# EAGLE board SparkFun_RTK_EVK (EAGLE 9.6.2), part 1 of 2
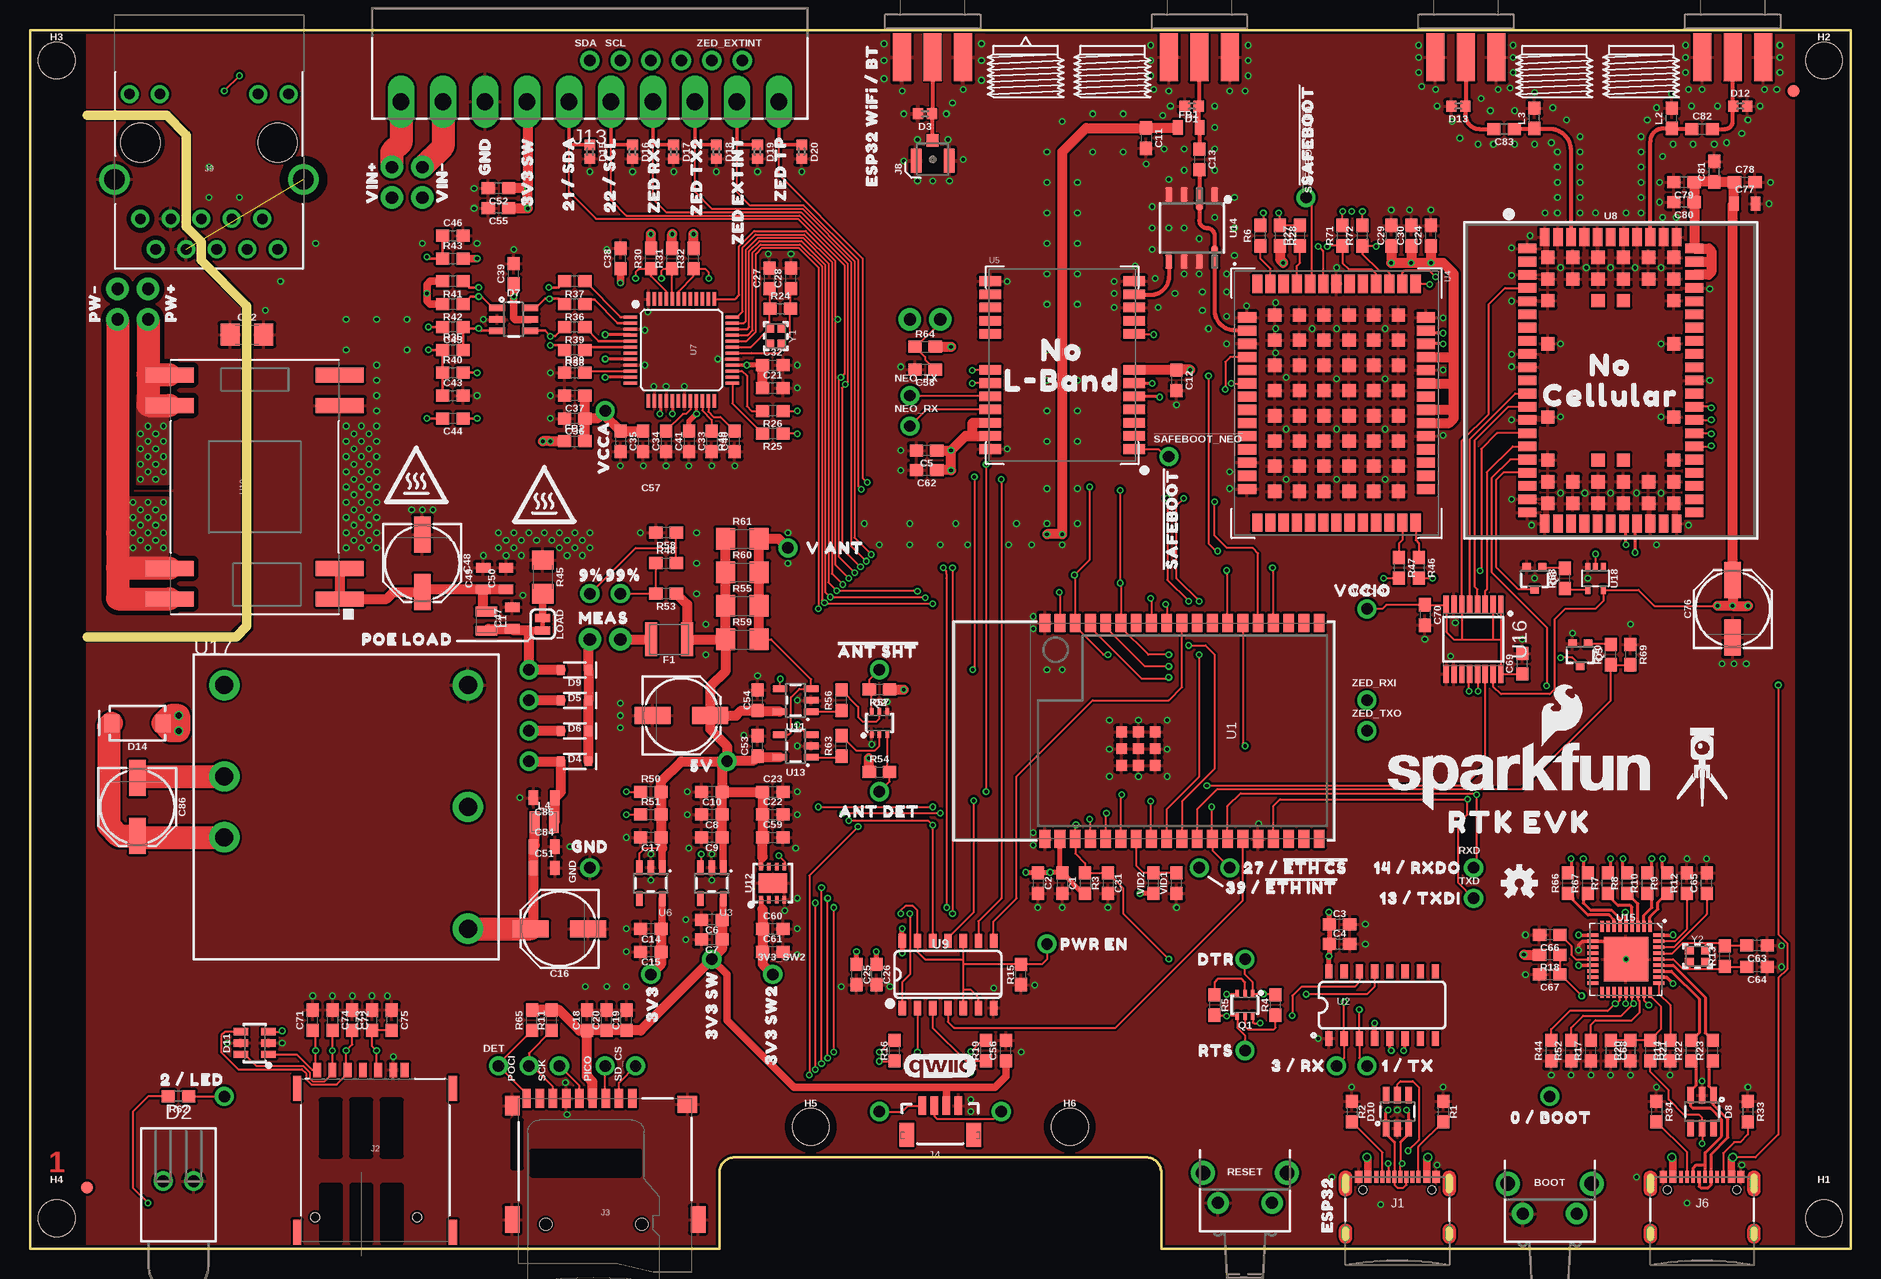
[diagram p2: board, top side]
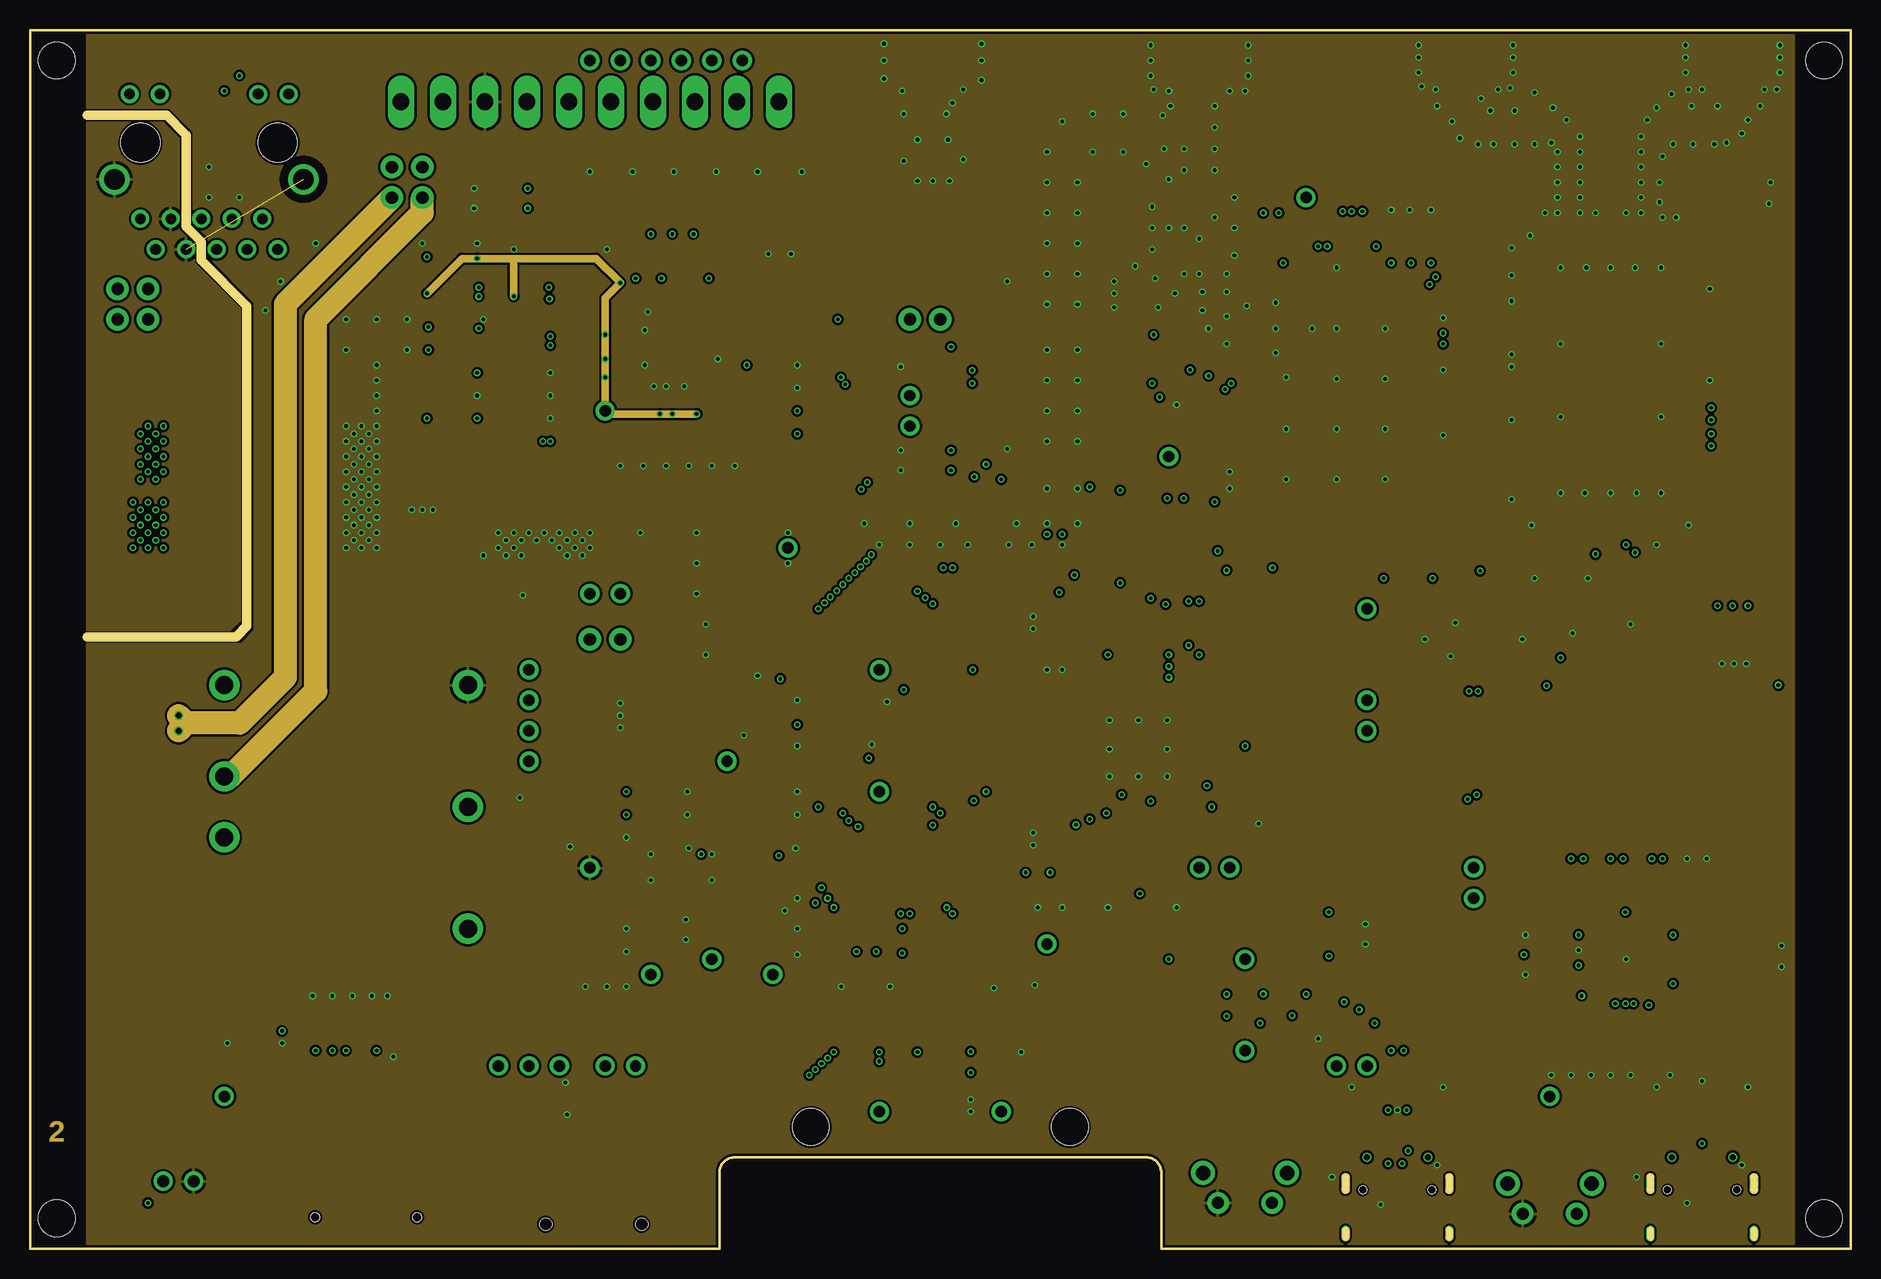
[diagram p3: board, inner layer Route2]
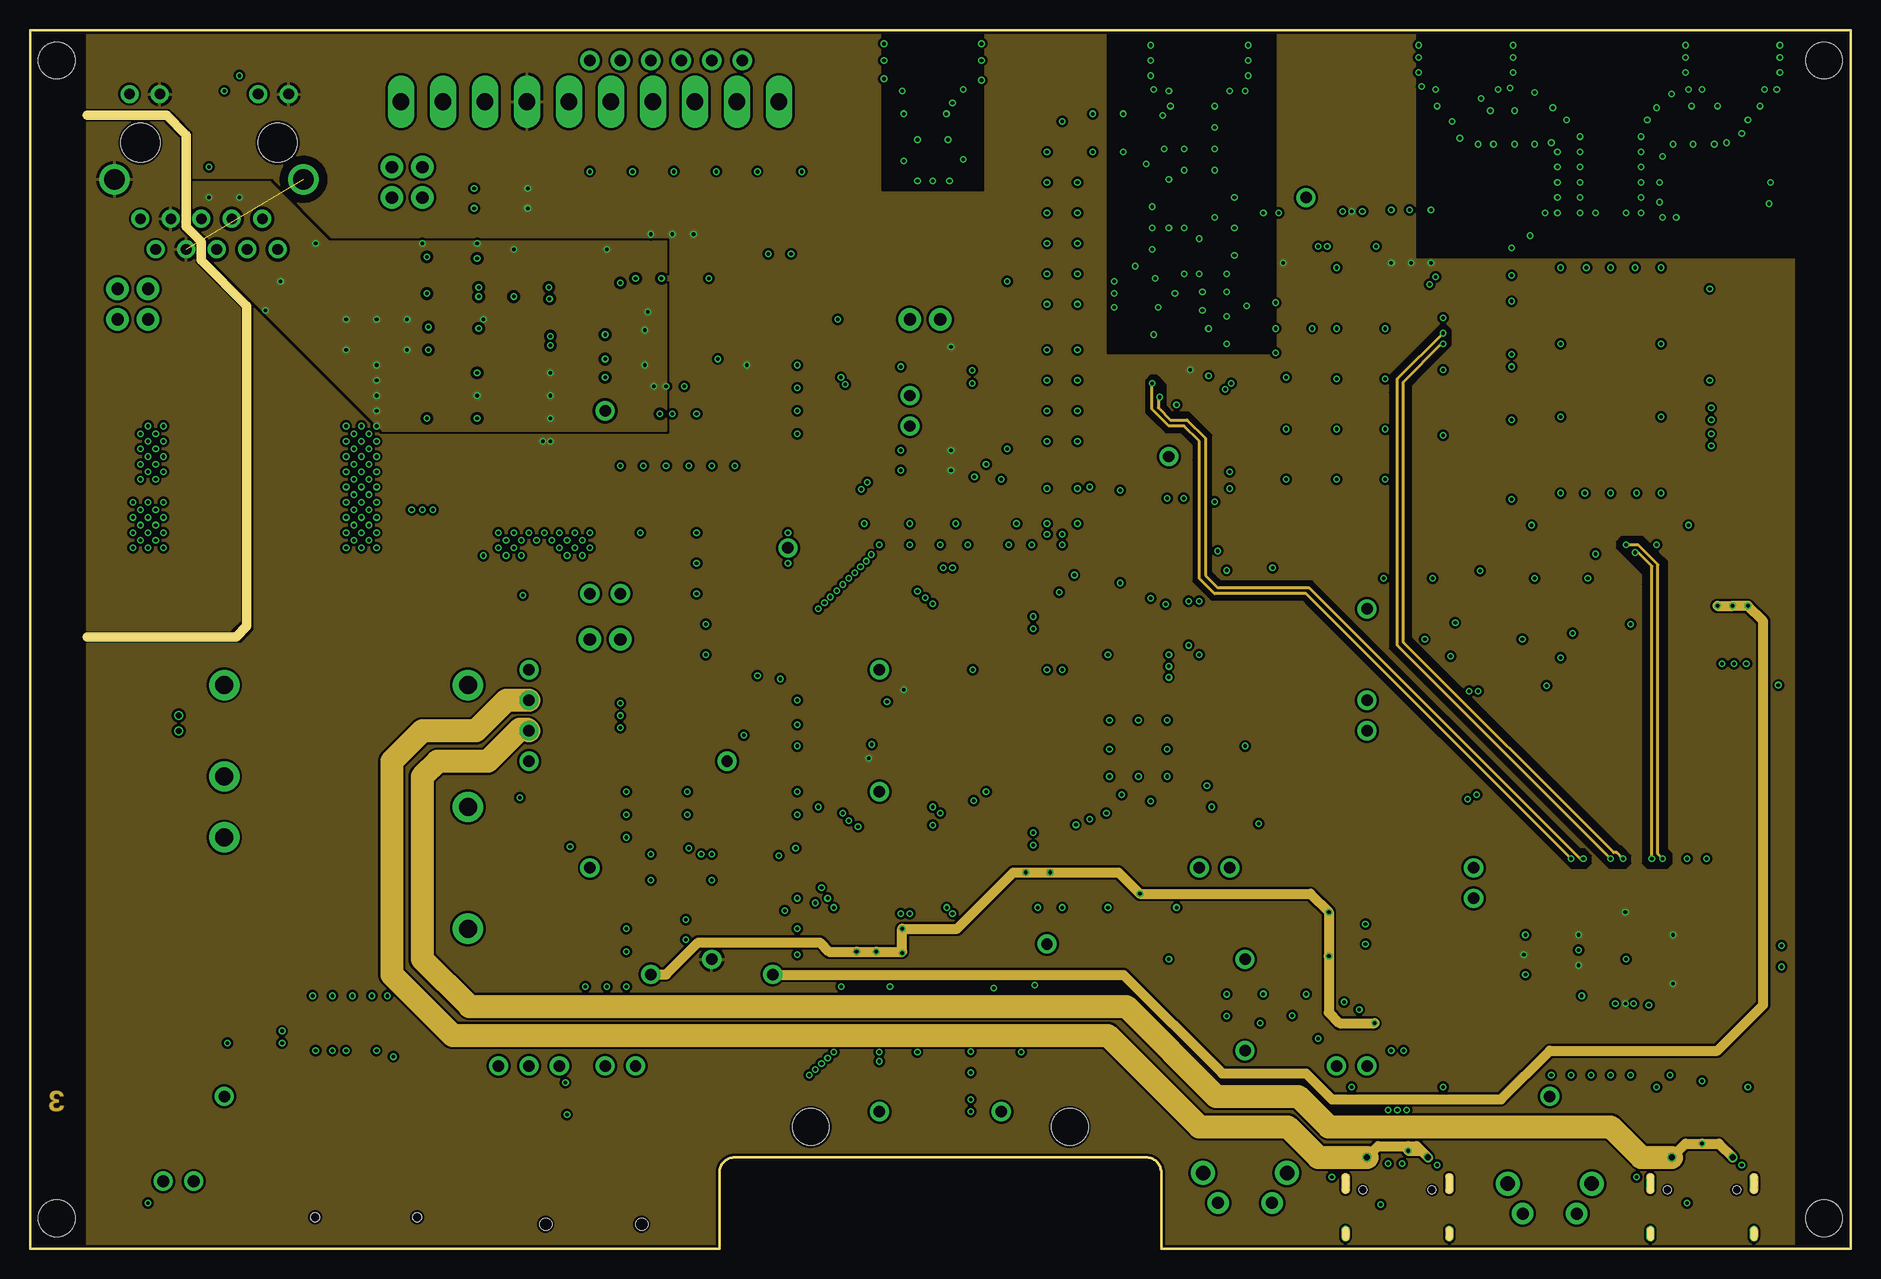
[diagram p4: board, inner layer Route15]
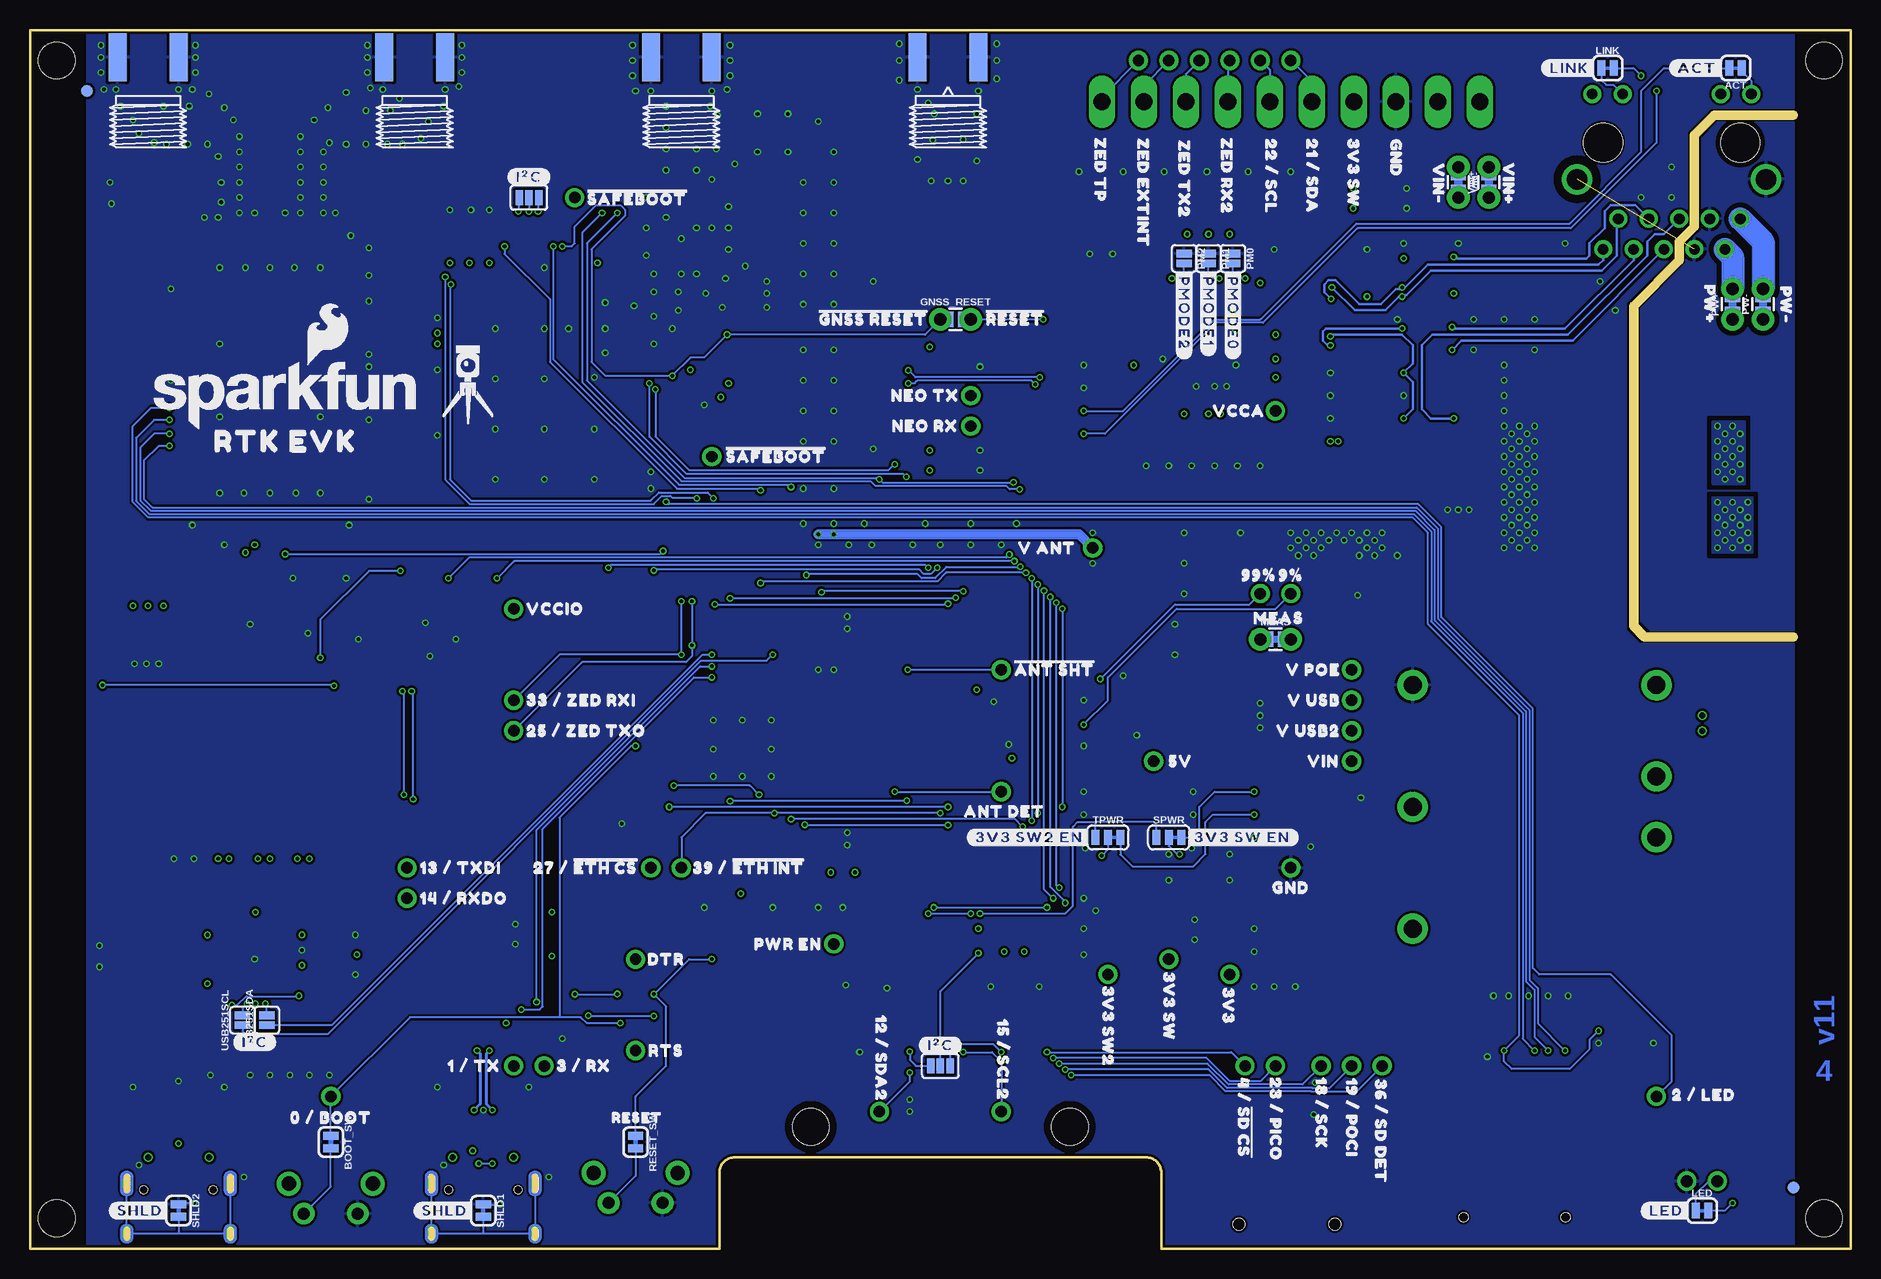
[diagram p5: board, bottom side, seen from below]

Size 151.77 x 101.6 mm. Coordinates in mm from the lower left corner, seen from the top.
Outline: 0,0 57.47,0 57.47,6.35 arc-90 58.74,7.62 93.03,7.62 arc-90 94.3,6.35 94.3,0 151.77,0 151.77,101.6 0,101.6 0,0
Copper layers (1*2*15*16): Top 0.035559375mm / dielectric 0.47751875mm / Route2 0.035559375mm / dielectric 0.47751875mm / Route15 0.035559375mm / dielectric 0.47751875mm / Bottom 0.035559375mm
Design rules "SparkFun-4-Layer-Minimum-JLCPCB": minimum track width 5mil, minimum drill 0.2mm, track to track 5mil, track to pad 5mil, pad to pad 5mil, via to via 5mil, smd to smd 5mil, copper to edge 7mil, drill to drill 7mil, minimum pad ring 5mil, minimum via ring 5mil, stop-mask expansion 2.5mil, vias tented up to drill 25mil, thermal gap 10mil
Net classes: 2 3.3V: width 0.508 mm; 3 RF_IN: width 0.35 mm, clearance 0.46 mm; 4 USB: width 0.203 mm, clearance 0.127 mm; 7 V_ZED: width 0.2 mm, clearance 0.2 mm; 8 V_RF: width 0.2 mm; 11 ZED_DIG: width 0.1 mm, clearance 0.1 mm
tKeepout: area 0,6.3 to 4.8,95.2; area 147,6.3 to 151.8,95.2
tRestrict: 1 lines
Milling: 9 lines

## Footprints (pad centres in the part's own frame; a part is rotated, then mirrored left to right if it is on the bottom)
1X01_NO_SILK = drill 0.95 pad 1.6: 1 0,0
SMT-JUMPER_2_NC_TRACE_SILK = smd 0.66 x 1.27: 1 -0.521,0; 2 0.521,0
TACTILE_SWITCH_PTH_RA_8-020 = drill 1 pad 1.8: 1 -2.25,0; 2 2.25,0 | drill 1.2 pad 2: M1 -3.5,2.5; M2 3.5,2.5
SMT-JUMPER_2_SOIC-PAD_NO-PASTE = smd 0.55 x 0.55: 1 1.75,0
0603 = smd 1.1 x 1: 1 -0.85,0; 2 0.85,0
PANASONIC_D = smd 3 x 1.4: + 2.4,0; - -2.4,0
1206 = smd 1.6 x 1.8: 1 -1.4,0; 2 1.4,0
0805 = smd 0.8 x 1.2: 1 -0.9,0; 2 0.9,0
0402 = smd 0.85 x 0.9: 1 -0.58,0; 2 0.58,0
CBI-RIGHT-ANGLE-PTH = drill 1 pad 1.6: A -1.27,5; C 1.27,5
SOD-323 = smd 0.63 x 0.83: A 1.15,0; C -1.15,0
SOT-23-6 = smd 0.55 x 1.35: 1 -0.95,-1.375; 2 0,-1.375; 3 0.95,-1.375; 4 0.95,1.375; 5 0,1.375; 6 -0.95,1.375
SOT23-6L = smd 0.6 x 1.2: 1 -0.95,-1.15; 2 0,-1.15; 3 0.95,-1.15; 4 0.95,1.15; 5 0,1.15; 6 -0.95,1.15
SMA-DIODE = smd 1.27 x 1.47: A -2.15,0; C 2.15,0
RP-SMA-EDGE = smd 1.5 x 4: GND@0 -2.54,0; GND@1 2.54,0; SIG 0,0 | smd 1.5 x 4 bottom: GND@2 -2.54,0; GND@3 2.54,0
1210 = smd 1 x 2.8: 1 -1.5,0; 2 1.5,0
FIDUCIAL-1X2 = smd 1 x 1: 1 0,0
COMBO-JUMPER_2_NO = smd 0.635 x 1.27: 1 -0.508,0; 2 0.508,0 | drill 1.016 pad 1.88: 3 -1.27,0; 4 1.27,0
SMA-EDGE = smd 1.5 x 4: GND@0 -2.54,0; GND@1 2.54,0; SIG 0,0 | smd 1.5 x 4 bottom: GND@2 -2.54,0; GND@3 2.54,0
STAND-OFF-TIGHT = hole 3.048: 0,0
SMT-JUMPER_3_NO_SILK = smd 0.635 x 1.27: 1 -0.813,0; 2 0,0; 3 0.813,0
USB-C-16P_4LAYER-PADS = smd 0.3 x 1: A5 -1.25,-0.34; A6 -0.25,-0.34; A7 0.25,-0.34; A8 1.25,-0.34; B5 1.75,-0.34; B6 0.75,-0.34; B7 -0.75,-0.34; B8 -1.75,-0.34 | smd 0.6 x 1: GND -3.225,-0.34; GND2 3.225,-0.34; VBUS1 -2.45,-0.34; VBUS2 2.45,-0.34 | drill 0.4 pad 0.6 long: SHLD1 -4.318,-0.915; SHLD2 4.318,-0.915; SHLD3 -4.318,-5.095; SHLD4 4.318,-5.095 | hole 0.65: -2.89,-1.445; 2.89,-1.445
NANO_SIM_PP = smd 0.7 x 2.1: A1 6.495,6; A2 -6.495,6; A3 -6.495,-6; A4 6.495,-6 | smd 0.65 x 1.23: C1 0.255,7.535; C2 -2.285,7.535; C3 -4.825,7.535; C5 1.525,7.535; C6 -1.015,7.535; C7 -3.555,7.535; CD 2.475,7.535 | hole 0.75: 3.505,-4.75; -4.995,-4.75
MICROSD-EXTERNALPIN = smd 0.7 x 1.6: 1 2.25,10.5; 2 1.15,10.5; 3 0.05,10.5; 4 -1.05,10.5; 5 -2.15,10.5; 6 -3.25,10.5; 7 -4.35,10.5; 8 -5.45,10.5; 9 -6.55,10.5 | smd 1.2 x 1.6: 10 -7.75,9.9 | smd 1.2 x 2.2: 11 -7.75,0.4; 12 7.75,0.4 | smd 1.6 x 1.4: 13 6.85,10 | hole 1: 3.05,0; -4.95,0
JST04_1MM_VERT = smd 0.6 x 1.55: 1 -1.5,0.775; 2 -0.5,0.775; 3 0.5,0.775; 4 1.5,0.775 | smd 1.2 x 2: NC1 -2.8,3.2; NC2 2.8,3.2
U.FL_REDUCED_FOOTPRINT = smd 2 x 0.85: 1 -0.1,1.375; 2 -0.1,-1.375 | smd 1.05 x 1: FEED 1.575,0
MAGJACK-SYM_LED = drill 0.9 pad 1.5: 1 -5.715,8.89; 2 -4.445,6.35; 3 -3.175,8.89; 4 -1.905,6.35; 5 -0.635,8.89; 6 0.635,6.35; 7 1.905,8.89; 8 3.175,6.35; 9 4.445,8.89; 10 5.715,6.35; 11 -6.63,-4.06; 12 -4.09,-4.06; 13 4.09,-4.06; 14 6.63,-4.06 | drill 1.7 pad 2.4: S1 -7.875,3.05; S2 7.875,3.05 | hole 3.25: -5.715,0; 5.715,0
1X10_SCREW_TERMINAL_3.5MM = drill 1.4 pad 2.2 long: 1 -15.75,2.8; 2 -12.25,2.8; 3 -8.75,2.8; 4 -5.25,2.8; 5 -1.75,2.8; 6 1.75,2.8; 7 5.25,2.8; 8 8.75,2.8; 9 12.25,2.8; 10 15.75,2.8
0805-WIDE = smd 0.8 x 1.8: 1 -0.8,0; 2 0.8,0
0603_NO-CREAM = smd 1.1 x 1: 1 -0.85,0; 2 0.85,0
COMBO-JUMPER_2_NC_TRACE = smd 0.635 x 1.27: 1 -0.508,0; 2 0.508,0 | drill 1.016 pad 1.88: 3 -1.27,0; 4 1.27,0
SMT-JUMPER_2_NO_SILK = smd 0.635 x 1.27: 1 -0.406,0; 2 0.406,0
SC70-6 = smd 0.3 x 0.66: 1 -0.65,-0.92; 2 0,-0.92; 3 0.65,-0.92; 4 0.65,0.92; 5 0,0.92; 6 -0.65,0.92
SOT323 = smd 0.7 x 0.7: 1 -0.65,-0.925; 2 0.65,-0.925; 3 0,0.925
SMT-JUMPER_3_1-NC_TRACE_SILK = smd 0.66 x 1.27: 1 -1.041,0; 2 0,0; 3 1.041,0
ESP32-WROVER-E/IE = smd 0.9 x 1.5: 1 7.8,9; 2 6.53,9; 3 5.26,9; 4 3.99,9; 5 2.72,9; 6 1.45,9; 7 0.18,9; 8 -1.09,9; 9 -2.36,9; 10 -3.63,9; 11 -4.9,9; 12 -6.17,9; 13 -7.44,9; 14 -8.71,9; 15 -9.98,9; 16 -11.25,9; 17 -12.52,9; 18 -13.79,9; 19 -15.06,9; 20 -15.06,-9; 21 -13.79,-9; 22 -12.52,-9; 23 -11.25,-9; 24 -9.98,-9; 25 -8.71,-9; 26 -7.44,-9; 27 -6.17,-9; 28 -4.9,-9; 29 -3.63,-9; 30 -2.36,-9; 31 -1.09,-9; 32 0.18,-9; 33 1.45,-9; 34 2.72,-9; 35 3.99,-9; 36 5.26,-9; 37 6.53,-9; 38 7.8,-9 | smd 0.9 x 0.9: GND 0,1.5; GNDT1 -1.4,2.9; GNDT2 -1.4,1.5; GNDT3 -1.4,0.1; GNDT4 0,0.1; GNDT5 1.4,0.1; GNDT6 1.4,1.5; GNDT7 1.4,2.9; GNDT8 0,2.9
SO016 = smd 0.6 x 1.2: 1 -4.445,-2.8; 2 -3.175,-2.8; 3 -1.905,-2.8; 4 -0.635,-2.8; 5 0.635,-2.8; 6 1.905,-2.8; 7 3.175,-2.8; 8 4.445,-2.8; 9 4.445,2.8; 10 3.175,2.8; 11 1.905,2.8; 12 0.635,2.8; 13 -0.635,2.8; 14 -1.905,2.8; 15 -3.175,2.8; 16 -4.445,2.8
SOT23-5 = smd 0.55 x 1.2: 1 -0.95,-1.3; 2 0,-1.3; 3 0.95,-1.3; 4 0.95,1.3; 5 -0.95,1.3
ZED-F9P = smd 0.85 x 1.52: 1 -7.15,-7.45; 2 -6.05,-7.45; 3 -4.95,-7.45; 4 -3.85,-7.45; 5 -2.75,-7.45; 6 -1.65,-7.45; 7 -0.55,-7.45; 8 0.55,-7.45; 9 1.65,-7.45; 10 2.75,-7.45; 11 3.85,-7.45; 12 4.95,-7.45; 13 6.05,-7.45; 14 7.15,-7.45; 28 7.15,7.45; 29 6.05,7.45; 30 4.95,7.45; 31 3.85,7.45; 32 2.75,7.45; 33 1.65,7.45; 34 0.55,7.45; 35 -0.55,7.45; 36 -1.65,7.45; 37 -2.75,7.45; 38 -3.85,7.45; 39 -4.95,7.45; 40 -6.05,7.45; 41 -7.15,7.45 | smd 1.52 x 0.85: 15 9.95,-6.6; 16 9.95,-5.5; 17 9.95,-4.4; 18 9.95,-3.3; 19 9.95,-2.2; 20 9.95,-1.1; 21 9.95,0; 22 9.95,1.1; 23 9.95,2.2; 24 9.95,3.3; 25 9.95,4.4; 26 9.95,5.5; 27 9.95,6.6; 42 -9.95,6.6; 43 -9.95,5.5; 44 -9.95,4.4; 45 -9.95,3.3; 46 -9.95,2.2; 47 -9.95,1.1; 48 -9.95,0; 49 -9.95,-1.1; 50 -9.95,-2.2; 51 -9.95,-3.3; 52 -9.95,-4.4; 53 -9.95,-5.5; 54 -9.95,-6.6 | smd 1.1 x 1.1: 55 -1.05,-1.05; 56 -3.15,-1.05; 57 -5.25,-1.05; 58 -7.35,-1.05; 59 -1.05,-3.1; 60 -3.15,-3.1; 61 -5.25,-3.1; 62 -7.35,-3.1; 63 -1.05,-5.15; 64 -3.15,-5.15; 65 -5.25,-5.15; 66 -7.35,-5.15; 67 -1.05,5.15; 68 -3.15,5.15; 69 -5.25,5.15; 70 -7.35,5.15; 71 -1.05,3.1; 72 -3.15,3.1; 73 -5.25,3.1; 74 -7.35,3.1; 75 -1.05,1.05; 76 -3.15,1.05; 77 -5.25,1.05; 78 -7.35,1.05; 79 1.05,1.05; 80 3.15,1.05; 81 5.25,1.05; 82 7.35,1.05; 83 1.05,3.1; 84 3.15,3.1; 85 5.25,3.1; 86 7.35,3.1; 87 1.05,5.15; 88 3.15,5.15; 89 5.25,5.15; 90 7.35,5.15; 91 1.05,-5.15; 92 3.15,-5.15; 93 5.25,-5.15; 94 7.35,-5.15; 95 1.05,-3.1; 96 3.15,-3.1; 97 5.25,-3.1; 98 7.35,-3.1; 99 1.05,-1.05; 100 3.15,-1.05; 101 5.25,-1.05; 102 7.35,-1.05
NEO-M9N/M8T/M8U/D9S = smd 1.8 x 0.8: 1 6,-7; 2 6,-5.9; 3 6,-4.8; 4 6,-3.7; 5 6,-2.6; 6 6,-1.5; 7 6,-0.4; 8 6,2.6; 9 6,3.7; 10 6,4.8; 11 6,5.9; 12 6,7; 13 -6,7; 14 -6,5.9; 15 -6,4.8; 16 -6,3.7; 17 -6,2.6; 18 -6,-0.4; 19 -6,-1.5; 20 -6,-2.6; 21 -6,-3.7; 22 -6,-4.8; 23 -6,-5.9; 24 -6,-7
LQFP-48 = smd 0.254 x 1.143: 1 -2.75,-4.25; 2 -2.25,-4.25; 3 -1.75,-4.25; 4 -1.25,-4.25; 5 -0.75,-4.25; 6 -0.25,-4.25; 7 0.25,-4.25; 8 0.75,-4.25; 9 1.25,-4.25; 10 1.75,-4.25; 11 2.25,-4.25; 12 2.75,-4.25; 25 2.75,4.25; 26 2.25,4.25; 27 1.75,4.25; 28 1.25,4.25; 29 0.75,4.25; 30 0.25,4.25; 31 -0.25,4.25; 32 -0.75,4.25; 33 -1.25,4.25; 34 -1.75,4.25; 35 -2.25,4.25; 36 -2.75,4.25 | smd 1.143 x 0.254: 13 4.25,-2.75; 14 4.25,-2.25; 15 4.25,-1.75; 16 4.25,-1.25; 17 4.25,-0.75; 18 4.25,-0.25; 19 4.25,0.25; 20 4.25,0.75; 21 4.25,1.25; 22 4.25,1.75; 23 4.25,2.25; 24 4.25,2.75; 37 -4.25,2.75; 38 -4.25,2.25; 39 -4.25,1.75; 40 -4.25,1.25; 41 -4.25,0.75; 42 -4.25,0.25; 43 -4.25,-0.25; 44 -4.25,-0.75; 45 -4.25,-1.25; 46 -4.25,-1.75; 47 -4.25,-2.25; 48 -4.25,-2.75
LARA-LGA = smd 0.8 x 1.5: 1 -11,-6.95; 2 -9.9,-6.95; 3 -8.8,-6.95; 4 -7.7,-6.95; 5 -6.6,-6.95; 6 -5.5,-6.95; 7 -4.4,-6.95; 8 -3.3,-6.95; 9 -2.2,-6.95; 10 -1.1,-6.95; 11 0,-6.95; 12 1.1,-6.95; 13 2.2,-6.95; 14 3.3,-6.95; 15 4.4,-6.95; 16 5.5,-6.95; 17 6.6,-6.95; 18 7.7,-6.95; 19 8.8,-6.95; 20 9.9,-6.95; 21 11,-6.95; 33 11,6.95; 34 9.9,6.95; 35 8.8,6.95; 36 7.7,6.95; 37 6.6,6.95; 38 5.5,6.95; 39 4.4,6.95; 40 3.3,6.95; 41 2.2,6.95; 42 1.1,6.95; 43 0,6.95; 44 -1.1,6.95; 45 -2.2,6.95; 46 -3.3,6.95; 47 -4.4,6.95; 48 -5.5,6.95; 49 -6.6,6.95; 50 -7.7,6.95; 51 -8.8,6.95; 52 -9.9,6.95; 53 -11,6.95 | smd 1.5 x 0.8: 22 11.95,-5.5; 23 11.95,-4.4; 24 11.95,-3.3; 25 11.95,-2.2; 26 11.95,-1.1; 27 11.95,0; 28 11.95,1.1; 29 11.95,2.2; 30 11.95,3.3; 31 11.95,4.4; 32 11.95,5.5; 54 -11.95,5.5; 55 -11.95,4.4; 56 -11.95,3.3; 57 -11.95,2.2; 58 -11.95,1.1; 59 -11.95,0; 60 -11.95,-1.1; 61 -11.95,-2.2; 62 -11.95,-3.3; 63 -11.95,-4.4; 64 -11.95,-5.5 | smd 1.1 x 1.1: 65 -10.25,-5.25; 66 -10.25,-3.15; 67 -10.25,-1.05; 68 -10.25,1.05; 69 -10.25,3.15; 70 -10.25,5.25; 71 -8.45,-5.25; 72 -8.45,-3.15; 73 -8.45,-1.05; 74 -8.45,1.05; 75 -8.45,3.15; 76 -8.45,5.25; 77 -6.65,-5.25; 78 -6.65,5.25; 79 -3.05,-5.25; 80 -3.05,5.25; 81 3.05,-5.25; 82 3.05,5.25; 83 6.65,-5.25; 84 6.65,5.25; 85 8.45,-5.25; 86 8.45,-3.15; 87 8.45,-1.05; 88 8.45,1.05; 89 8.45,3.15; 90 8.45,5.25; 91 10.25,-5.25; 92 10.25,-3.15; 93 10.25,-1.05; 94 10.25,1.05; 95 10.25,3.15; 96 10.25,5.25; 97 -6.65,-1.05; 98 -6.65,1.05; 99 6.65,-1.05; 100 6.65,1.05
SO14 = smd 0.6 x 1.2: 1 -3.175,-2.8; 2 -1.905,-2.8; 3 -0.635,-2.8; 4 0.635,-2.8; 5 1.905,-2.8; 6 3.175,-2.8; 7 4.445,-2.8; 8 4.445,2.8; 9 3.175,2.8; 10 1.905,2.8; 11 0.635,2.8; 12 -0.635,2.8; 13 -1.905,2.8; 14 -3.175,2.8
DP990X = smd 1.25 x 4: 1 -9.33,-7.1; 2 -6.79,-7.1; 3 6.79,-7.1; 4 9.33,-7.1; 5 9.33,7.1; 6 6.79,7.1; 7 -6.79,7.1; 8 -9.33,7.1
UDFN-8 = smd 0.3 x 0.65: 1 -0.975,-1.375; 2 -0.325,-1.375; 3 0.325,-1.375; 4 0.975,-1.375; 5 0.975,1.375; 6 0.325,1.375; 7 -0.325,1.375; 8 -0.975,1.375 | smd 2.35 x 1.6: EP 0,0
XX21 = smd 0.6 x 1.2: 1 -1.905,-2.8; 2 -0.635,-2.8; 3 0.635,-2.8; 4 1.905,-2.8; 5 1.905,2.8; 6 0.635,2.8; 7 -0.635,2.8; 8 -1.905,2.8
QFN-36 = smd 0.9 x 0.28: 1 -2.75,2; 2 -2.75,1.5; 3 -2.75,1; 4 -2.75,0.5; 5 -2.75,0; 6 -2.75,-0.5; 7 -2.75,-1; 8 -2.75,-1.5; 9 -2.75,-2; 19 2.75,-2; 20 2.75,-1.5; 21 2.75,-1; 22 2.75,-0.5; 23 2.75,0; 24 2.75,0.5; 25 2.75,1; 26 2.75,1.5; 27 2.75,2 | smd 0.28 x 0.9: 10 -2,-2.75; 11 -1.5,-2.75; 12 -1,-2.75; 13 -0.5,-2.75; 14 0,-2.75; 15 0.5,-2.75; 16 1,-2.75; 17 1.5,-2.75; 18 2,-2.75; 28 2,2.75; 29 1.5,2.75; 30 1,2.75; 31 0.5,2.75; 32 0,2.75; 33 -0.5,2.75; 34 -1,2.75; 35 -1.5,2.75; 36 -2,2.75 | smd 3.7 x 3.7: EP 0,0
SOP65P640X120-16N = smd 1.5 x 0.45: 1 -2.9,2.275; 2 -2.9,1.625; 3 -2.9,0.975; 4 -2.9,0.325; 5 -2.9,-0.325; 6 -2.9,-0.975; 7 -2.9,-1.625; 8 -2.9,-2.275; 9 2.9,-2.275; 10 2.9,-1.625; 11 2.9,-0.975; 12 2.9,-0.325; 13 2.9,0.325; 14 2.9,0.975; 15 2.9,1.625; 16 2.9,2.275
URB_YMD-15WR3 = drill 1.499 pad 2.54: 1 -10.16,10.16; 2 -10.16,2.54; 3 -10.16,-2.54; 4 10.16,-10.16; 5 10.16,0; 6 10.16,10.16
SOT353 = smd 0.42 x 0.7: 1 -0.65,-0.95; 2 0,-0.95; 3 0.65,-0.95; 4 0.65,0.95; 5 -0.65,0.95
CRYSTAL-SMD-2.0X1.6MM = smd 0.75 x 0.7: 1 -0.675,-0.5; 2 0.675,-0.5; 3 0.675,0.5; 4 -0.675,0.5

## Placement (x,y rotation side)
3V3  TEST-POINTPOGO_PTH  [1X01_NO_SILK]  51.75,22.86 270 top
3V3_SW  TEST-POINTPOGO_PTH  [1X01_NO_SILK]  56.83,24.13 270 top
3V3_SW2  TEST-POINTPOGO_PTH  [1X01_NO_SILK]  61.91,22.86 0 top
5V  TEST-POINTPOGO_PTH  [1X01_NO_SILK]  58.1,40.64 270 top
9%  TEST-POINTPOGO_PTH  [1X01_NO_SILK]  46.67,54.61 0 top
99%  TEST-POINTPOGO_PTH  [1X01_NO_SILK]  49.21,54.61 0 top
!SAFEBOOT_NEO!  TEST-POINTPOGO_PTH  [1X01_NO_SILK]  94.93,66.04 0 top
!SAFEBOOT_ZED!  TEST-POINTPOGO_PTH  [1X01_NO_SILK]  106.36,87.63 0 top
ACT  JUMPER-SMT_2_NC_TRACE_SILK  [SMT-JUMPER_2_NC_TRACE_SILK]  9.59,98.42 180 bottom
ANT_DET  TEST-POINTPOGO_PTH  [1X01_NO_SILK]  70.8,38.1 0 top
ANT_SHT  TEST-POINTPOGO_PTH  [1X01_NO_SILK]  70.8,48.26 0 top
BOOT  MOMENTARY-SWITCH-SPST-PTH-RIGHT-ANGLE-8-020  [TACTILE_SWITCH_PTH_RA_8-020]  126.68,2.92 0 top
BOOT_SW  JUMPER-SMT_2_NC_TRACE_SILK  [SMT-JUMPER_2_NC_TRACE_SILK]  126.68,8.89 270 bottom
BYPASS1  NO PASTE  [SMT-JUMPER_2_SOIC-PAD_NO-PASTE]  97.47,85.09 90 top
BYPASS2  NO PASTE  [SMT-JUMPER_2_SOIC-PAD_NO-PASTE]  98.74,85.09 270 top
C1  2.2uF  [0603]  86.04,30.48 270 top
C2  0.1uF  [0603]  84.01,30.48 270 top
C3  2.2uF  [0603]  109.16,27.05 0 top
C4  10nF  [0603]  109.16,25.4 0 top
C5  2.2uF  [0603]  74.74,66.55 180 top
C6  2.2uF  [0603]  56.83,27.43 180 top
C7  0.1uF  [0603]  56.83,25.78 180 top
C8  2.2uF  [0603]  56.83,36.2 180 top
C9  2.2uF  [0603]  56.83,34.29 180 top
C10  2.2uF  [0603]  56.83,38.1 180 top
C11  47pF  [0603]  93.03,92.58 270 top
C12  1.0uF  [0603]  95.57,72.39 270 top
C13  47pF  [0603]  97.47,90.81 270 top
C14  2.2uF  [0603]  51.75,26.67 180 top
C15  0.1uF  [0603]  51.75,24.77 180 top
C16  100uF  [PANASONIC_D]  44.13,26.67 180 top
C17  0.1uF  [0603]  51.75,34.29 180 top
C18  2.2uF  [0603]  46.42,19.05 90 top
C19  0.1uF  [0603]  49.72,19.05 90 top
C20  10uF  [0603]  48.07,19.05 90 top
C21  0.1uF  [0603]  61.91,71.75 0 top
C22  2.2uF  [0603]  61.91,36.2 0 top
C23  2.2uF  [0603]  61.91,38.1 0 top
C24  1.0uF  [0603]  116.78,84.45 90 top
C25  2.2uF  [0603]  68.9,22.86 270 top
C26  2.2uF  [0603]  70.55,22.86 270 top
C27  10pF  [0603]  61.66,80.9 90 top
C28  10pF  [0603]  63.44,80.9 90 top
C29  2.2uF  [0603]  113.47,84.45 90 top
C30  0.1uF  [0603]  115.13,84.45 90 top
C31  0.1uF  [0603]  89.85,30.48 270 top
C32  10uF  [0603]  61.91,73.66 0 top
C33  0.1uF  [0603]  54.93,67.31 270 top
C34  0.1uF  [0603]  51.12,67.31 270 top
C35  0.1uF  [0603]  49.21,67.31 270 top
C36  0.1uF  [0603]  45.4,69.22 180 top
C37  0.1uF  [0603]  45.4,71.12 180 top
C38  0.1uF  [0603]  49.21,82.55 90 top
C39  10uF  [0603]  40.32,81.28 90 top
C40  10nF  [0603]  56.83,67.31 270 top
C41  4.7uF  [0603]  53.02,67.31 270 top
C42  1nF  [1206]  18.08,76.2 0 top
C43  10nF  [0603]  35.24,71.12 0 top
C44  6.8nF  [0603]  35.24,69.22 180 top
C45  6.8nF  [0603]  35.24,76.83 180 top
C46  22nF  [0603]  35.24,84.45 0 top
C47  10uF  [0805]  40.2,52.58 90 top
C48  100uF  [PANASONIC_D]  32.7,57.15 270 top
C49  10uF  [0805]  37.78,55.88 90 top
C50  10uF  [0805]  39.69,55.88 90 top
C51  10uF  [0805]  42.86,31.75 0 top
C52  0.1uF  [0603]  39.05,88.39 180 top
C53  0.1uF  [0603]  60.64,41.91 90 top
C54  0.1uF  [0603]  60.64,45.72 90 top
C55  10uF  [0603]  39.05,86.74 180 top
C56  2.2uF  [0603]  81.34,16.51 90 top
C57  100uF  [PANASONIC_D]  54.29,44.45 0 top
C58  0.1uF  [0603]  74.61,73.28 180 top
C59  2.2uF  [0603]  61.91,34.29 0 top
C60  2.2uF  [0603]  61.91,26.67 0 top
C61  0.1uF  [0603]  61.91,24.77 0 top
C62  0.1uF  [0603]  74.74,64.9 180 top
C63  18pF  [0603]  143.95,25.27 180 top
C64  18pF  [0603]  143.95,23.5 180 top
C65  0.1uF  [0603]  139.76,30.48 90 top
C66  0.1uF  [0603]  126.68,26.16 180 top
C67  0.1uF  [0603]  126.68,22.86 180 top
C68  0.1uF  [0603]  131.76,16.51 270 top
C69  0.1uF  [0603]  124.4,48.77 90 top
C70  0.1uF  [0603]  116.27,52.83 270 top
C71  47pF  [0603]  23.56,19.05 90 top
C72  47pF  [0603]  26.86,19.05 270 top
C73  47pF  [0603]  28.51,19.05 90 top
C74  47pF  [0603]  25.21,19.05 270 top
C75  0.1uF  [0603]  30.16,19.05 270 top
C76  100uF  [PANASONIC_D]  141.92,53.34 90 top
C77  10uF  [0805]  142.94,87.12 0 top
C78  0.1uF  [0603]  142.94,88.9 0 top
C79  15pF  [0603]  137.86,88.9 180 top
C80  8.2pF  [0603]  137.86,87.25 180 top
C81  68pF  [0603]  140.4,89.79 90 top
C82  33pF  [0603]  139.38,93.34 0 top
C83  33pF  [0603]  122.87,93.34 180 top
C84  10uF  [0805]  42.86,33.53 0 top
C85  10uF  [0805]  42.86,37.59 180 top
C86  47UF  [PANASONIC_D]  8.95,36.83 270 top
D1  PESD0402-0402  [0402]  96.84,95.25 180 top
D2  LED-RIGHT-ANGLE-PTH-GREEN  [CBI-RIGHT-ANGLE-PTH]  12.38,0.64 0 top
D3  PESD0402  [0402]  74.61,94.61 180 top
D4  3A/10V/280mV  [SOD-323]  45.4,40.64 180 top
D5  3A/10V/280mV  [SOD-323]  45.4,45.72 180 top
D6  3A/10V/280mV  [SOD-323]  45.4,43.18 180 top
D7  ESD Diode  [SOT-23-6]  40.32,77.47 270 top
D8  ESD Diode  [SOT-23-6]  139.38,11.43 180 top
D9  3A/10V/280mV  [SOD-323]  45.4,48.26 180 top
D10  ESD Diode  [SOT-23-6]  113.98,11.43 0 top
D11  TVS_DIODE  [SOT23-6L]  18.73,17.14 90 top
D12  PESD0402-0402  [0402]  142.56,95.25 0 top
D13  PESD0402-0402  [0402]  119.06,95.25 180 top
D14  3A/40V  [SMA-DIODE]  8.95,43.81 180 top
D15  PESD0402-0402  [0402]  46.67,91.44 270 top
D16  PESD0402-0402  [0402]  50.23,91.44 270 top
D17  PESD0402-0402  [0402]  53.66,91.44 270 top
D18  PESD0402-0402  [0402]  57.21,91.44 270 top
D19  PESD0402-0402  [0402]  60.64,91.44 270 top
D20  PESD0402-0402  [0402]  64.33,91.44 270 top
DET  TEST-POINTPOGO_PTH  [1X01_NO_SILK]  39.05,15.24 0 top
DTR  TEST-POINTPOGO_PTH  [1X01_NO_SILK]  101.28,24.13 0 top
ESP32_RF  ANTENNA-SMA-GROUNDEDEDGE_RPSMA  [RP-SMA-EDGE]  75.25,99.31 0 top
ETH_CS  TEST-POINTPOGO_PTH  [1X01_NO_SILK]  100.01,31.75 0 top
ETH_INT  TEST-POINTPOGO_PTH  [1X01_NO_SILK]  97.47,31.75 0 top
F1  6V/2A  [1210]  53.28,50.8 180 top
FB1  600Ω  [0805]  96.58,93.47 0 top
FB2  470Ω  [0603]  45.4,67.31 0 top
FD1  FIDUCIAL1X2  [FIDUCIAL-1X2]  4.76,5.08 0 bottom
FD2  FIDUCIAL1X2  [FIDUCIAL-1X2]  4.76,5.08 0 top
FD3  FIDUCIAL1X2  [FIDUCIAL-1X2]  147,96.52 0 bottom
FD4  FIDUCIAL1X2  [FIDUCIAL-1X2]  147,96.52 0 top
FRAME1  FRAME-LEDGER  [CREATIVE_COMMONS]  185.1,0 0 top  (outside the outline)
FRAME2  FRAME-LEDGERNO_FOOTPRINT  [DUMMY]  185.1,1.27 0 top  (outside the outline)
GND  TEST-POINTPOGO_PTH  [1X01_NO_SILK]  46.67,31.75 90 top
GNSS_RESET  JUMPER-COMBO_2_NO  [COMBO-JUMPER_2_NO]  74.61,77.47 0 bottom
GNSS_RF  ANTENNA-SMA-GROUNDEDEDGE_SMA  [SMA-EDGE]  97.47,99.31 0 top
H1  STAND-OFFTIGHT  [STAND-OFF-TIGHT]  149.54,2.54 0 top
H2  STAND-OFFTIGHT  [STAND-OFF-TIGHT]  149.54,99.06 0 top
H3  STAND-OFFTIGHT  [STAND-OFF-TIGHT]  2.22,99.06 0 top
H4  STAND-OFFTIGHT  [STAND-OFF-TIGHT]  2.22,2.54 0 top
H5  STAND-OFFTIGHT  [STAND-OFF-TIGHT]  65.09,10.16 0 top
H6  STAND-OFFTIGHT  [STAND-OFF-TIGHT]  86.68,10.16 0 top
I2C  JUMPER-SMT_3_NO_SILK  [SMT-JUMPER_3_NO_SILK]  75.88,15.24 0 bottom
I2C1  JUMPER-SMT_3_NO_SILK  [SMT-JUMPER_3_NO_SILK]  110.17,87.63 0 bottom
J1  [USB-C-16P_4LAYER-PADS]  113.98,6.35 0 top
J2  [NANO_SIM_PP]  28.77,7.37 0 top
J3  MICRO-SD-PUSH-PUSH-EXT-PIN  [MICROSD-EXTERNALPIN]  47.94,2.03 0 top
J4  Vertical Qwiic Connector  [JST04_1MM_VERT]  75.88,12.7 180 top
J6  [USB-C-16P_4LAYER-PADS]  139.38,6.35 0 top
J8  [U.FL_REDUCED_FOOTPRINT]  75.25,90.81 90 top
J9  MAGJACK-POE  [MAGJACK-SYM_LED]  14.92,92.2 180 top
J13  [1X10_SCREW_TERMINAL_3.5MM]  46.67,98.42 180 top
L1  2.2uH  [0805-WIDE]  38.04,52.32 270 top
L2  DNP  [0603_NO-CREAM]  136.84,94.23 90 top
L3  DNP  [0603_NO-CREAM]  125.41,94.23 90 top
L4  2.2uH  [0805-WIDE]  42.86,35.56 0 top
LARA_RF1  ANTENNA-SMA-GROUNDEDEDGE_SMA  [SMA-EDGE]  141.92,99.31 0 top
LARA_RF2  ANTENNA-SMA-GROUNDEDEDGE_SMA  [SMA-EDGE]  119.7,99.31 0 top
LED  JUMPER-SMT_2_NC_TRACE_SILK  [SMT-JUMPER_2_NC_TRACE_SILK]  12.38,3.17 0 bottom
LINK  JUMPER-SMT_2_NC_TRACE_SILK  [SMT-JUMPER_2_NC_TRACE_SILK]  20.26,98.42 0 bottom
LOAD  JUMPER-SMT_2_NC_TRACE_SILK  [SMT-JUMPER_2_NC_TRACE_SILK]  42.74,52.07 270 top
LOGO1  SPECIAL_INSTRUCTIONS-ORDERING  [ORDERING_INSTRUCTIONS]  157.16,60.96 0 top  (outside the outline)
LOGO2  QWIIC_LOGO_6MM  [QWIIC_6MM]  75.88,15.24 0 top
LOGO4  OSHW-LOGOS  [OSHW-LOGO-S]  124.14,30.48 0 top
LOGO5  SFE_LOGO_NAME.2_INCH  [SFE_LOGO_NAME_.2]  124.14,39.37 0 top
LOGO6  SFE_LOGO_FLAME.2_INCH  [SFE_LOGO_FLAME_.2]  127.7,44.45 0 top
LOGO7  SFE_LOGO_NAME.2_INCH  [SFE_LOGO_NAME_.2]  130.49,71.12 0 bottom
LOGO8  SFE_LOGO_FLAME.2_INCH  [SFE_LOGO_FLAME_.2]  126.94,76.2 0 bottom
MEAS  JUMPER-COMBO_2_NC_TRACE  [COMBO-JUMPER_2_NC_TRACE]  47.94,50.8 0 bottom
NEO_RX  TEST-POINTPOGO_PTH  [1X01_NO_SILK]  73.34,68.58 0 top
NEO_TX  TEST-POINTPOGO_PTH  [1X01_NO_SILK]  73.34,71.12 0 top
PICO  TEST-POINTPOGO_PTH  [1X01_NO_SILK]  47.94,15.24 90 top
PM0  JUMPER-SMT_2_NO_SILK  [SMT-JUMPER_2_NO_SILK]  51.5,82.55 270 bottom
PM1  JUMPER-SMT_2_NO_SILK  [SMT-JUMPER_2_NO_SILK]  53.53,82.55 270 bottom
PM2  JUMPER-SMT_2_NO_SILK  [SMT-JUMPER_2_NO_SILK]  55.56,82.55 270 bottom
POCI  TEST-POINTPOGO_PTH  [1X01_NO_SILK]  41.59,15.24 90 top
PW+  JUMPER-COMBO_2_NC_TRACE  [COMBO-JUMPER_2_NC_TRACE]  9.84,78.74 90 bottom
PW-  JUMPER-COMBO_2_NC_TRACE  [COMBO-JUMPER_2_NC_TRACE]  7.3,78.74 90 bottom
PWREN  TEST-POINTPOGO_PTH  [1X01_NO_SILK]  84.77,25.4 0 top
Q1  [SC70-6]  101.28,20.32 180 top
Q2  [SC70-6]  70.8,43.81 0 top
Q5  310mA/60V/1.6Ω  [SOT323]  129.22,49.53 180 top
Q6  310mA/60V/1.6Ω  [SOT323]  125.41,55.88 180 top
R1  5.1k  [0603]  117.79,11.43 270 top
R2  5.1k  [0603]  110.17,11.43 270 top
R3  10k  [0603]  87.95,30.48 270 top
R4  10k  [0603]  103.82,20.32 90 top
R5  10k  [0603]  98.74,20.32 270 top
R6  33  [0603]  102.55,84.45 90 top
R7  27  [0603]  131.51,30.48 90 top
R8  27  [0603]  133.16,30.48 90 top
R9  27  [0603]  136.46,30.48 90 top
R10  27  [0603]  134.81,30.48 90 top
R11  10k  [0603]  43.5,19.05 90 top
R12  12k  [0603]  138.11,30.48 90 top
R13  1M  [0603]  141.29,24.38 90 top
R14  100k  [0603]  136.72,16.51 90 top
R15  10k  [0603]  82.61,22.86 90 top
R16  2.2k  [0603]  72.07,16.51 90 top
R17  100k  [0603]  130.11,16.51 90 top
R18  100k  [0603]  126.68,24.51 180 top
R19  2.2k  [0603]  79.69,16.51 90 top
R20  100k  [0603]  133.41,16.51 90 top
R21  100k  [0603]  135.06,16.51 270 top
R22  27  [0603]  138.49,16.51 90 top
R23  27  [0603]  140.27,16.51 90 top
R24  1M  [0603]  62.55,78.36 0 top
R25  1k  [0603]  61.91,67.94 180 top
R26  1k  [0603]  61.91,69.85 180 top
R27  33  [0603]  105.85,84.45 90 top
R28  10k  [0603]  104.2,84.45 270 top
R29  12.4k  [0603]  45.4,73.03 0 top
R30  10k  [0603]  51.75,82.55 90 top
R31  10k  [0603]  53.53,82.55 90 top
R32  10k  [0603]  55.31,82.55 90 top
R33  5.1k  [0603]  143.19,11.43 270 top
R34  5.1k  [0603]  135.57,11.43 270 top
R35  49.9  [0603]  35.24,74.93 0 top
R36  33  [0603]  45.4,78.74 180 top
R37  33  [0603]  45.4,80.64 180 top
R38  33  [0603]  45.4,74.93 180 top
R39  33  [0603]  45.4,76.83 180 top
R40  49.9  [0603]  35.24,73.03 0 top
R41  49.9  [0603]  35.24,80.64 180 top
R42  49.9  [0603]  35.24,78.74 180 top
R43  10  [0603]  35.24,82.55 0 top
R44  100k  [0603]  126.81,16.51 90 top
R45  49.9 1/2W  [1206]  42.74,56.01 270 top
R46  33  [0603]  115.76,56.77 270 top
R47  33  [0603]  114.11,56.77 270 top
R48  100k  [0603]  53.02,57.15 0 top
R49  10k  [0603]  58.74,67.31 90 top
R50  100k  [0603]  51.75,38.1 0 top
R51  100k  [0603]  51.75,36.2 0 top
R52  100k  [0603]  128.46,16.51 90 top
R53  1k  [0603]  53.02,54.61 180 top
R54  10k  [0603]  70.8,39.75 0 top
R55  49.9 1/2W  [1206]  59.37,53.59 0 top
R56  1k  [0603]  67.63,45.72 90 top
R57  10k  [0603]  70.8,46.61 180 top
R58  10k  [0603]  53.02,59.69 180 top
R59  49.9 1/2W  [1206]  59.37,50.8 0 top
R60  49.9 1/2W  [1206]  59.37,56.39 0 top
R61  49.9 1/2W  [1206]  59.37,59.18 0 top
R62  470  [0603]  12.38,12.7 180 top
R63  1k  [0603]  67.63,41.91 90 top
R64  10k  [0603]  74.61,75.18 0 top
R65  100k  [0603]  41.85,19.05 90 top
R66  27  [0603]  128.21,30.48 90 top
R67  27  [0603]  129.86,30.48 90 top
R68  1k  [0603]  127.95,55.88 90 top
R69  100k  [0603]  133.41,49.53 270 top
R70  1k  [0603]  131.76,49.53 90 top
R71  2.2k  [0603]  109.41,84.45 90 top
R72  2.2k  [0603]  111.06,84.45 90 top
RESET  MOMENTARY-SWITCH-SPST-PTH-RIGHT-ANGLE-8-020  [TACTILE_SWITCH_PTH_RA_8-020]  101.28,3.81 0 top
RESET_SW  JUMPER-SMT_2_NC_TRACE_SILK  [SMT-JUMPER_2_NC_TRACE_SILK]  101.28,8.89 270 bottom
RTS  TEST-POINTPOGO_PTH  [1X01_NO_SILK]  101.28,16.51 0 top
RX  TEST-POINTPOGO_PTH  [1X01_NO_SILK]  108.9,15.24 0 top
RX2  TEST-POINTPOGO_PTH  [1X01_NO_SILK]  51.75,99.06 0 top
RXD  TEST-POINTPOGO_PTH  [1X01_NO_SILK]  120.33,31.75 0 top
SCK  TEST-POINTPOGO_PTH  [1X01_NO_SILK]  44.13,15.24 90 top
SCL  TEST-POINTPOGO_PTH  [1X01_NO_SILK]  49.21,99.06 0 top
SCL2  TEST-POINTPOGO_PTH  [1X01_NO_SILK]  70.8,11.43 0 top
SD_CS  TEST-POINTPOGO_PTH  [1X01_NO_SILK]  50.48,15.24 90 top
SDA  TEST-POINTPOGO_PTH  [1X01_NO_SILK]  46.67,99.06 0 top
SDA2  TEST-POINTPOGO_PTH  [1X01_NO_SILK]  80.96,11.43 0 top
SHLD1  JUMPER-SMT_2_NC_TRACE_SILK  [SMT-JUMPER_2_NC_TRACE_SILK]  113.98,3.17 270 bottom
SHLD2  JUMPER-SMT_2_NC_TRACE_SILK  [SMT-JUMPER_2_NC_TRACE_SILK]  139.38,3.17 270 bottom
SPWR  JUMPER-SMT_3_1-NC_TRACE_SILK  [SMT-JUMPER_3_1-NC_TRACE_SILK]  56.83,34.29 0 bottom
TP  TEST-POINTPOGO_PTH  [1X01_NO_SILK]  59.37,99.06 0 top
TP_BOOT  TEST-POINTPOGO_PTH  [1X01_NO_SILK]  126.68,12.7 0 top
TP_LED  TEST-POINTPOGO_PTH  [1X01_NO_SILK]  16.19,12.7 0 top
TPWR  JUMPER-SMT_3_1-NC_TRACE_SILK  [SMT-JUMPER_3_1-NC_TRACE_SILK]  61.91,34.29 0 bottom
TX  TEST-POINTPOGO_PTH  [1X01_NO_SILK]  111.44,15.24 0 top
TX2  TEST-POINTPOGO_PTH  [1X01_NO_SILK]  54.29,99.06 0 top
TXD  TEST-POINTPOGO_PTH  [1X01_NO_SILK]  120.33,29.21 0 top
U1  ESP32-WROVER-IE  [ESP32-WROVER-E/IE]  92.39,43.18 180 top
U2  CH340C  [SO016]  112.71,20.32 0 top
U3  XC6222B331MR-G  [SOT23-5]  56.83,30.48 180 top
U4  U-BLOX_ZED-F9P  [ZED-F9P]  108.9,70.48 270 top
U5  U-BLOX_NEO-D9S-00B  [NEO-M9N/M8T/M8U/D9S]  86.04,73.66 0 top
U6  XC6222B331MR-G  [SOT23-5]  51.75,30.48 180 top
U7  W5500  [LQFP-48]  54.29,74.93 270 top
U8  LARA-R6001D  [LARA-LGA]  131.76,72.39 270 top
U9  74LVC4066D_QUAD_BILATERAL_SWITCH  [SO14]  75.88,22.86 0 top
U10  POE_PSU-DP990X  [DP990X]  18.73,63.5 90 top
U11  MCP6021T  [SOT23-5]  63.82,45.72 90 top
U12  AP7361C-33  [UDFN-8]  61.91,30.48 0 top
U13  MCP6021T  [SOT23-5]  63.82,41.91 90 top
U14  BP2G1+_POWER_SPLITTER  [XX21]  96.84,85.09 180 top
U15  USB251XB_USB2514B  [QFN-36]  133.03,24.13 270 top
U16  SN74AVC4T774PW  [SOP65P640X120-16N]  120.33,50.8 270 top
U17  URB2405YMD  [URB_YMD-15WR3]  26.35,36.83 0 top
U18  74HC1G04  [SOT353]  130.49,55.88 180 top
U$2  [33_#_ZED_RXI0]  111.06,45.72 0 bottom
U$3  [#SHLD#0]  140.02,3.17 0 bottom
U$4  [#I�C#0]  110.17,89.34 0 bottom
U$5  [PW#0]  5.4,76.58 90 top
U$6  [PW#1]  11.75,76.58 90 top
U$7  [0_#_BOOT0]  126.81,10.92 0 top
U$8  [#SAFEBOOT#2226]  101.16,87.63 0 bottom
U$9  [#ACT#0]  10.48,98.42 0 bottom
U$10  [#LINK#1]  21.15,98.42 0 bottom
U$11  [RTK_EVK0]  124.14,35.56 0 top
U$12  [#SAFEBOOT#2226]  106.36,92.84 90 top
U$13  [RTK_EVK0]  130.49,67.31 0 bottom
U$14  [NEO_TX2]  77.15,71.12 0 bottom
U$15  [NEO_RX3]  77.15,68.58 0 bottom
U$16  [GND2]  37.91,91.06 90 top
U$17  [3V3_SW20]  61.79,18.67 90 top
U$18  [GND2]  37.91,90.93 270 bottom
U$19  [12_#_SDA20]  80.84,15.88 270 bottom
U$20  [15_#_SCL213]  70.68,15.75 270 bottom
U$21  [ESP32_WIFI_#_BT0]  70.17,101.09 90 top
U$22  [3V3_SW3]  41.47,89.79 90 top
U$23  [3V3_SW3]  41.47,89.66 270 bottom
U$24  [VCCA0]  47.82,66.8 90 top
U$25  [21_#_SDA4]  44.89,89.66 90 top
U$26  [21_#_SDA4]  44.89,89.41 270 bottom
U$28  [22_#_SCL22]  48.32,89.53 90 top
U$29  [27_#_#ETH_CS#0]  105.47,31.88 0 top
U$30  [22_#_SCL22]  48.32,89.41 270 bottom
U$31  [ZED_RX223]  52.01,89.53 90 top
U$32  [ZED_RX223]  52.01,89.41 270 bottom
U$33  [ZED_TX2224]  55.56,89.41 90 top
U$34  [1_#_TX20]  114.87,15.24 0 top
U$35  [3_#_RX20]  105.73,15.24 0 top
U$36  [ZED_TX2224]  55.56,89.15 270 bottom
U$37  [ZED_EXTINT2225]  58.99,88.27 90 top
U$38  [ZED_EXTINT2225]  58.99,88.01 270 bottom
U$39  [ZED_TP2226]  62.55,90.04 90 top
U$40  [ZED_TP2226]  62.55,89.92 270 bottom
U$41  [#SAFEBOOT#2226]  95.06,60.83 90 top
U$42  [ANT_DET2227]  70.8,36.45 0 top
U$43  [#ANT_SHT#2228]  70.68,49.91 0 top
U$44  [9#2230]  46.8,56.13 0 top
U$45  [#SHLD#0]  114.62,3.17 0 bottom
U$46  [#I�C#0]  75.88,16.95 0 bottom
U$47  [99#2230]  49.47,56.13 0 top
U$48  [#I�C#0]  133.03,17.21 0 bottom
U$49  [V_ANT2229]  67.12,58.42 0 top
U$55  [RTS2231]  98.87,16.51 0 top
U$56  [DTR2232]  98.87,24.13 0 top
U$57  [2_#_LED0]  12.26,12.83 0 bottom
U$58  [#LED#2234]  13.27,3.17 0 bottom
U$59  [3V3_SW25]  56.83,23.88 90 top
U$60  [3V325]  51.88,22.61 90 top
U$61  [5V25]  57.72,40.26 0 top
U$62  [MEAS2]  50.61,52.58 0 top
U$63  [VIN#0]  28.51,88.77 270 bottom
U$64  [36_#_SD_DET0]  39.18,9.78 270 bottom
U$65  [3V3_SW20]  61.91,18.54 270 bottom
U$66  [2_#_LED0]  13.53,14.1 0 top
U$67  [#PMODE0#0]  51.5,77.98 270 bottom
U$68  [#PMODE1#1]  53.53,78.11 270 bottom
U$69  [#PMODE2#2]  55.56,77.98 270 bottom
U$70  [VIN#0]  28.51,88.9 90 top
U$71  [VIN#1]  34.35,88.77 270 bottom
U$72  [VIN#1]  34.35,88.9 90 top
U$73  [14_#_RXDO0]  111.32,31.75 0 top
U$74  [#RESET#0]  69.66,77.6 0 bottom
U$75  [13_#_TXDI15]  111.82,29.21 0 top
U$76  [RTS2231]  98.74,16.51 0 bottom
U$77  [DTR2232]  98.74,24.13 0 bottom
U$78  [ESP320]  108.14,3.68 90 top
U$79  [39_#_#ETH_INT#0]  99,30.23 0 top
U$80  [PWR_EN2233]  88.58,25.4 0 bottom
U$81  [V_POE0]  41.85,48.26 0 bottom
U$82  [V_USB3]  41.85,45.72 0 bottom
U$83  [V_USB24]  41.85,43.18 0 bottom
U$84  [MEAS2]  44.89,52.58 0 bottom
U$85  [VIN1]  41.97,40.64 0 bottom
U$86  [5V25]  54.17,40.64 0 bottom
U$87  [3V325]  51.88,18.03 270 bottom
U$88  [3V3_SW25]  56.83,16.64 270 bottom
U$89  [4_#_#SD_CS#15]  50.48,10.92 270 bottom
U$90  [25_#_ZED_TXO0]  111.06,43.18 0 bottom
U$91  [NO0]  86.04,74.93 0 top
U$92  [NO0]  131.76,73.66 0 top
U$93  [#SAFEBOOT#2226]  89.6,66.17 0 bottom
U$94  [ANT_DET2227]  70.55,36.45 0 bottom
U$95  [#ANT_SHT#2228]  66.36,48.39 0 bottom
U$96  [CELLULAR2]  131.76,71.12 0 top
U$97  [L#BAND1]  86.04,72.39 0 top
U$98  [23_#_PICO23]  47.94,10.79 270 bottom
U$99  [1_#_TX20]  114.74,15.24 0 bottom
U$100  [3_#_RX20]  105.6,15.24 0 bottom
U$101  [19_#_POCI19]  41.59,10.92 270 bottom
U$102  [18_#_SCK6]  44.13,11.3 270 bottom
U$103  [13_#_TXDI15]  119.95,31.75 0 bottom
U$104  [99#2230]  49.34,56.13 0 bottom
U$105  [V_ANT2229]  66.99,58.42 0 bottom
U$106  [9#2230]  46.67,56.13 0 bottom
U$107  [VCCA0]  50.99,69.85 0 bottom
U$108  [14_#_RXDO0]  119.95,29.21 0 bottom
U$110  [39_#_#ETH_INT#0]  97.22,31.88 0 bottom
U$111  [27_#_#ETH_CS#0]  105.47,31.88 0 bottom
U$113  [PW#0]  5.4,80.9 270 bottom
U$114  [PW#1]  11.75,81.03 270 bottom
U$115  [VCCIO0]  108.01,54.86 0 top
U$116  [VCCIO0]  111.06,53.34 0 bottom
U$117  [#3V3_SW_EN#0]  55.44,34.29 0 bottom
U$118  [#3V3_SW2_EN#0]  63.31,34.29 0 bottom
U$135  [GND12]  46.67,30.1 0 bottom
U$136  [POE_LOAD0]  31.43,50.8 0 top
U$141  [PWR_EN2233]  88.71,25.4 0 top
U$143  [GND12]  46.67,33.53 0 top
U$146  [HIGH_TEMP_WARNING]  42.86,62.23 0 top
U$147  [HIGH_TEMP_WARNING]  32.19,63.88 0 top
U$148  [RESET0]  101.16,10.92 0 bottom
U$149  [0_#_BOOT0]  126.68,10.92 0 bottom
U$152  [RTK5#SVG0]  139.38,40.13 0 top
U$153  [RTK5#SVG0]  115.25,72.01 0 bottom
U$154  [#GNSS_RESET#0]  81.47,77.6 0 bottom
USB251SCL  [SMT-JUMPER_2_NO_SILK]  134.05,19.05 90 bottom
USB251SDA  [SMT-JUMPER_2_NO_SILK]  132.02,19.05 90 bottom
VANT  TEST-POINTPOGO_PTH  [1X01_NO_SILK]  63.18,58.42 0 top
VCCA  TEST-POINTPOGO_PTH  [1X01_NO_SILK]  47.94,69.85 0 top
VCCIO  TEST-POINTPOGO_PTH  [1X01_NO_SILK]  111.44,53.34 0 top
VID1  10k  [0603]  95.57,30.48 90 top
VID2  1k  [0603]  93.66,30.48 90 top
VIN  TEST-POINTPOGO_PTH  [1X01_NO_SILK]  41.59,40.64 0 top
VIN+  JUMPER-COMBO_2_NC_TRACE  [COMBO-JUMPER_2_NC_TRACE]  30.16,88.9 90 bottom
VIN-  JUMPER-COMBO_2_NC_TRACE  [COMBO-JUMPER_2_NC_TRACE]  32.7,88.9 270 bottom
VPOE  TEST-POINTPOGO_PTH  [1X01_NO_SILK]  41.59,48.26 0 top
VUSB  TEST-POINTPOGO_PTH  [1X01_NO_SILK]  41.59,45.72 0 top
VUSB2  TEST-POINTPOGO_PTH  [1X01_NO_SILK]  41.59,43.18 0 top
Y1  25MHz  [CRYSTAL-SMD-2.0X1.6MM]  62.17,76.07 270 top
Y2  24MHz  [CRYSTAL-SMD-2.0X1.6MM]  139,24.38 0 top
ZED_EXTINT  TEST-POINTPOGO_PTH  [1X01_NO_SILK]  56.83,99.06 0 top
ZED_RXI  TEST-POINTPOGO_PTH  [1X01_NO_SILK]  111.44,45.72 0 top
ZED_TXO  TEST-POINTPOGO_PTH  [1X01_NO_SILK]  111.44,43.18 0 top